# Altium schematic sheet 3V-Switcher-50mA.SchDoc
size A4; Organization: UNSW Solar Racing Team; Address3: UNSW; Address4: Sydney NSW 2052; Address2: Electrical Engineering; Address1: Rm 109
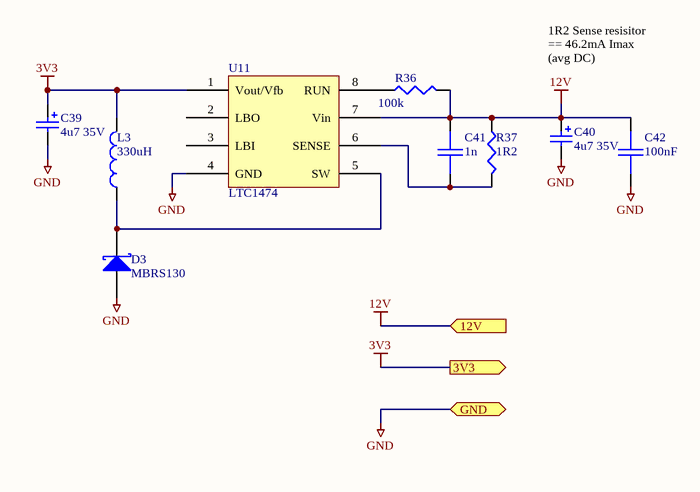
[diagram p0: 3V-Switcher-50mA.SchDoc]

## Parts
C39  4u7 35V  [MCCT-CASEC]
C40  4u7 35V  [MCCT-CASEC]
C41  1n  [0603]
C42  100nF  [0603]
D3  MBRS130  [SMB]
L3  330uH  [1812]
R36  100k  [0603]
R37  1R2  [0603]
U11  LTC1474  [SO8]

## Ports
3V3 (out), 12V (in), GND (bidir)

## Nets
3V3: C39.1 L3.2 U11.1(Vout/Vfb) ; port 3V3
12V: C40.1 C41.1 C42.1 R36.2 R37.1 U11.7(Vin) ; port 12V
GND: C39.2 C40.2 C42.2 D3.A U11.4(GND) ; port GND
NetC41_2: C41.2 R37.2 U11.6(SENSE)
NetD3_K: D3.K L3.1 U11.5(SW)
NetR36_1: R36.1 U11.8(RUN)

Not connected (* = marked no-connect by the designer): U11 2(LBO) 3(LBI)

## Notes on the sheet
- 1R2 Sense resisitor == 46.2mA Imax (avg DC)
- Title
- Size:
- Date:
- A4
- Number:
- Time:
- Revision:
- Sheet
- of
- File:

## Library data of the parts
C39 C40 = Cap Pol3: Polarized Capacitor (Surface Mount); Value: 4.7uF; Order#: 197-609; Revision: July-2002: Re-released for DXP Platform.; Price: 1.41; Supplier: Farnell
C41 = CAP: Capacitor; Value: 1nF; Order#: 317-202; Revision: July-2002: Re-released for DXP Platform.; Price: 0.15; Supplier: Farnell
C42 = CAP: Capacitor; Value: 0.1uF; Order#: 753-567; Revision: July-2002: Re-released for DXP Platform.; Price: 0.31; Supplier: Farnell
D3 = D SCHOTTKY: Schottky Diode; Order#: 9556931; Revision: July-2002: Re-released for DXP Platform.; Price: 1.49; Supplier: Farnell
L3 = Inductor: Order#: 8808538; Revision: July-2002: Re-released for DXP Platform.; Value: 330uH; Price: 1.96; Supplier: Farnell
R36 = RES1: Resistor; Order#: 933-3738; Value: 100k; Price: 0.13; Supplier: Farnell
R37 = RES1: Resistor; Value: 1.2R; Order#: 139-9658; Revision: July-2002: Re-released for DXP Platform.; Price: 0.63; Supplier: Farnell
U11 = LTC1474: Step-down converter; Order#: LTC1474CMS8-3.3-ND; Price: 7.50USD; Supplier: Digikey